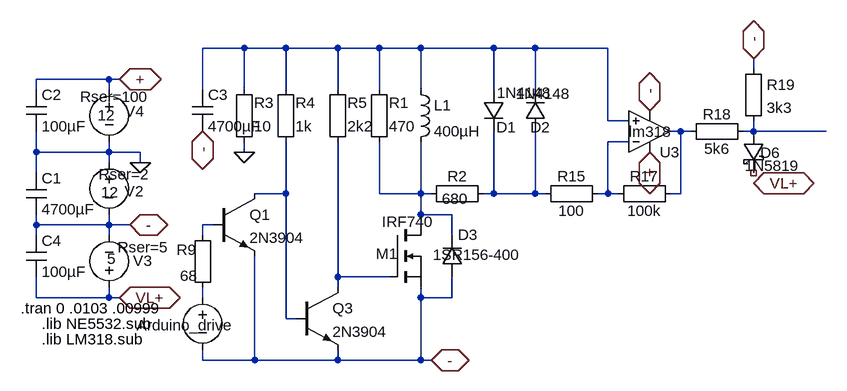
[diagram p0: schematic metal_1110.asc]
metal_1110.asc, the LTspice schematic file:
Version 4
SHEET 1 6068 1612
WIRE 128 -2400 64 -2400
WIRE 192 -2400 128 -2400
WIRE 272 -2400 192 -2400
WIRE 336 -2400 272 -2400
WIRE 400 -2400 336 -2400
WIRE 512 -2400 400 -2400
WIRE 576 -2400 512 -2400
WIRE 688 -2400 576 -2400
WIRE 912 -2368 912 -2384
WIRE -80 -2352 -192 -2352
WIRE -64 -2352 -80 -2352
WIRE -192 -2336 -192 -2352
WIRE -80 -2336 -80 -2352
WIRE 64 -2336 64 -2400
WIRE 128 -2336 128 -2400
WIRE 192 -2336 192 -2400
WIRE 272 -2336 272 -2400
WIRE 336 -2336 336 -2400
WIRE 400 -2336 400 -2400
WIRE 512 -2336 512 -2400
WIRE 576 -2336 576 -2400
WIRE 688 -2288 688 -2400
WIRE 720 -2288 688 -2288
WIRE 800 -2272 784 -2272
WIRE 816 -2272 800 -2272
WIRE 912 -2272 912 -2288
WIRE 912 -2272 896 -2272
WIRE 1024 -2272 912 -2272
WIRE 720 -2256 688 -2256
WIRE 912 -2256 912 -2272
WIRE -192 -2240 -192 -2272
WIRE -80 -2240 -80 -2256
WIRE -80 -2240 -192 -2240
WIRE -32 -2240 -80 -2240
WIRE 128 -2240 128 -2256
WIRE -80 -2224 -80 -2240
WIRE -32 -2224 -32 -2240
WIRE -192 -2208 -192 -2240
WIRE 192 -2176 192 -2256
WIRE 192 -2176 144 -2176
WIRE 336 -2176 336 -2256
WIRE 400 -2176 400 -2256
WIRE 400 -2176 336 -2176
WIRE 416 -2176 400 -2176
WIRE 512 -2176 512 -2272
WIRE 512 -2176 496 -2176
WIRE 576 -2176 576 -2272
WIRE 576 -2176 512 -2176
WIRE 592 -2176 576 -2176
WIRE 688 -2176 688 -2256
WIRE 688 -2176 672 -2176
WIRE 704 -2176 688 -2176
WIRE 800 -2176 800 -2272
WIRE 800 -2176 784 -2176
WIRE 400 -2144 400 -2176
WIRE 448 -2144 400 -2144
WIRE -192 -2128 -192 -2144
WIRE -80 -2128 -80 -2144
WIRE -80 -2128 -192 -2128
WIRE -48 -2128 -80 -2128
WIRE 80 -2128 64 -2128
WIRE 400 -2128 400 -2144
WIRE -192 -2112 -192 -2128
WIRE -80 -2112 -80 -2128
WIRE 64 -2112 64 -2128
WIRE 448 -2112 448 -2144
WIRE 272 -2048 272 -2256
WIRE 352 -2048 272 -2048
WIRE 272 -2032 272 -2048
WIRE -192 -2016 -192 -2048
WIRE -80 -2016 -80 -2032
WIRE -80 -2016 -192 -2016
WIRE -64 -2016 -80 -2016
WIRE 64 -2016 64 -2032
WIRE 400 -2016 400 -2032
WIRE 448 -2016 448 -2048
WIRE 448 -2016 400 -2016
WIRE 192 -1984 192 -2176
WIRE 208 -1984 192 -1984
WIRE 64 -1920 64 -1936
WIRE 144 -1920 144 -2080
WIRE 144 -1920 64 -1920
WIRE 272 -1920 272 -1936
WIRE 272 -1920 144 -1920
WIRE 400 -1920 400 -2016
WIRE 400 -1920 272 -1920
WIRE 416 -1920 400 -1920
FLAG 64 -2272 -
IOPIN 64 -2272 BiDir
FLAG -48 -2128 -
IOPIN -48 -2128 BiDir
FLAG -64 -2352 +
IOPIN -64 -2352 BiDir
FLAG -32 -2224 0
FLAG 128 -2240 0
FLAG -64 -2016 VL+
IOPIN -64 -2016 BiDir
FLAG 752 -2240 +
IOPIN 752 -2240 BiDir
FLAG 752 -2304 -
IOPIN 752 -2304 BiDir
FLAG 912 -2384 -
IOPIN 912 -2384 BiDir
FLAG 912 -2192 VL+
IOPIN 912 -2192 BiDir
FLAG 416 -1920 -
IOPIN 416 -1920 BiDir
SYMBOL Misc\\EuropeanCap 48 -2336 R0
SYMATTR InstName C3
SYMATTR Value 4700µF
SYMATTR SpiceLine V=400 Irms=1 Rser=.32 Lser=0
SYMBOL ind 384 -2352 R0
SYMATTR InstName L1
SYMATTR Value 400µH
SYMATTR SpiceLine Rser=.5 Cpar=200p
SYMBOL Misc\\EuropeanResistor 320 -2240 M180
WINDOW 0 31 76 Left 2
WINDOW 3 31 40 Left 2
SYMATTR InstName R1
SYMATTR Value 470
SYMBOL Misc\\EuropeanResistor 400 -2192 M90
WINDOW 0 5 56 VBottom 2
WINDOW 3 8 53 VTop 2
SYMATTR InstName R2
SYMATTR Value 680
SYMBOL diode 496 -2336 R0
WINDOW 3 21 5 Left 2
WINDOW 0 20 58 Left 2
SYMATTR Value 1N4148
SYMATTR InstName D1
SYMBOL diode 592 -2272 R180
WINDOW 0 -7 6 Left 2
WINDOW 3 -39 58 Left 2
SYMATTR InstName D2
SYMATTR Value 1N4148
SYMBOL Misc\\EuropeanResistor 112 -2240 M180
WINDOW 0 31 76 Left 2
WINDOW 3 31 40 Left 2
SYMATTR InstName R3
SYMATTR Value 10
SYMBOL nmos 352 -2128 R0
WINDOW 0 -21 44 Left 2
WINDOW 3 -12 -5 Left 2
SYMATTR InstName M1
SYMATTR Value IRF740
SYMBOL voltage 64 -2032 M0
WINDOW 0 -48 58 Left 2
WINDOW 3 -134 119 Invisible 2
WINDOW 123 0 0 Left 2
SYMATTR InstName Arduino_drive
SYMATTR Value PULSE(0 4.8 .01 0 0 .00015 .1 1000)
SYMATTR SpiceLine Rser=0
SYMBOL voltage -80 -2240 M0
WINDOW 123 0 0 Left 2
WINDOW 39 -63 34 Left 2
WINDOW 0 -53 60 Left 2
WINDOW 3 -15 62 Left 2
SYMATTR SpiceLine Rser=2
SYMATTR InstName V2
SYMATTR Value 12
SYMBOL voltage -80 -2352 M0
WINDOW 123 0 0 Left 2
WINDOW 39 -61 27 Left 2
WINDOW 0 -54 49 Left 2
WINDOW 3 -9 55 Left 2
SYMATTR SpiceLine Rser=100
SYMATTR InstName V4
SYMATTR Value 12
SYMBOL voltage -80 -2016 M180
WINDOW 123 0 0 Left 2
WINDOW 39 13 78 Left 2
WINDOW 0 37 57 Left 2
WINDOW 3 -3 60 Left 2
SYMATTR SpiceLine Rser=5
SYMATTR InstName V3
SYMATTR Value 5
SYMBOL npn3 80 -2176 R0
SYMATTR InstName Q1
SYMATTR Value 2N3904
SYMBOL Misc\\EuropeanResistor 176 -2240 M180
WINDOW 0 31 76 Left 2
WINDOW 3 31 40 Left 2
SYMATTR InstName R4
SYMATTR Value 1k
SYMBOL Misc\\EuropeanResistor 48 -2016 M180
WINDOW 0 -24 74 Left 2
WINDOW 3 -19 34 Left 2
SYMATTR InstName R9
SYMATTR Value 68
SYMBOL Misc\\EuropeanCap -208 -2208 R0
SYMATTR InstName C1
SYMATTR Value 4700µF
SYMATTR SpiceLine V=400 Irms=1 Rser=.32 Lser=0
SYMBOL Misc\\EuropeanCap -208 -2336 R0
SYMATTR InstName C2
SYMATTR Value 100µF
SYMATTR SpiceLine V=400 Irms=1 Rser=.32 Lser=0
SYMBOL Misc\\EuropeanCap -208 -2112 R0
SYMATTR InstName C4
SYMATTR Value 100µF
SYMATTR SpiceLine V=400 Irms=1 Rser=.32 Lser=0
SYMBOL Opamps\\opamp2 752 -2208 M180
WINDOW 3 -32 63 Left 2
SYMATTR Value lm318
SYMATTR InstName U3
SYMBOL Misc\\EuropeanResistor 576 -2160 R270
WINDOW 0 27 56 VTop 2
WINDOW 3 5 56 VBottom 2
SYMATTR InstName R15
SYMATTR Value 100
SYMBOL Misc\\EuropeanResistor 688 -2160 R270
WINDOW 0 27 56 VTop 2
WINDOW 3 5 56 VBottom 2
SYMATTR InstName R17
SYMATTR Value 100k
SYMBOL Misc\\EuropeanResistor 800 -2288 M90
WINDOW 0 5 56 VBottom 2
WINDOW 3 27 56 VTop 2
SYMATTR InstName R18
SYMATTR Value 5k6
SYMBOL Misc\\EuropeanResistor 896 -2384 R0
SYMATTR InstName R19
SYMATTR Value 3k3
SYMBOL schottky 928 -2272 M0
WINDOW 0 -25 33 Left 2
WINDOW 3 -55 53 Left 2
SYMATTR InstName D6
SYMATTR Value 1N5819
SYMATTR Description Diode
SYMATTR Type diode
SYMBOL npn3 208 -2032 R0
SYMATTR InstName Q3
SYMATTR Value 2N3904
SYMBOL diode 464 -2048 R180
WINDOW 0 -24 65 Left 2
WINDOW 3 -90 34 Left 2
SYMATTR InstName D3
SYMATTR Value 1SR156-400
SYMATTR Description Zener Diode
SYMATTR Type zener
SYMBOL Misc\\EuropeanResistor 256 -2240 M180
WINDOW 0 31 76 Left 2
WINDOW 3 31 40 Left 2
SYMATTR InstName R5
SYMATTR Value 2k2
TEXT -216 -2000 Left 2 !.tran 0 .0103 .00999
TEXT -184 -1976 Left 2 !.lib NE5532.sub
TEXT -184 -1952 Left 2 !.lib LM318.sub

The netlist it stands for:
* metal_1110.asc
C3 N001 - 4700µF V=400 Irms=1 Rser=.32 Lser=0
L1 N001 N006 400µH Rser=.5 Cpar=200p
R1 N006 N001 470
R2 N006 N007 680
D1 N001 N007 1N4148
D2 N007 N001 1N4148
R3 0 N001 10
M1 N006 N009 - - IRF740
V§Arduino_drive N010 - PULSE(0 4.8 .01 0 0 .00015 .1 1000) Rser=0
V2 0 - 12 Rser=2
V4 + 0 12 Rser=100
V3 VL+ - 5 Rser=5
Q1 N005 N008 - 0 2N3904
R4 N005 N001 1k
R9 N010 N008 68
C1 0 - 4700µF V=400 Irms=1 Rser=.32 Lser=0
C2 + 0 100µF V=400 Irms=1 Rser=.32 Lser=0
C4 - VL+ 100µF V=400 Irms=1 Rser=.32 Lser=0
XU3 N001 N004 + - N002 lm318  ; pins In+ In- V+ V- OUT
R15 N007 N004 100
R17 N004 N002 100k
R18 N002 N003 5k6
R19 - N003 3k3
D6 N003 NC_01 1N5819
Q3 N009 N005 - 0 2N3904
D3 - N006 1SR156-400
R5 N009 N001 2k2
.model D D
.lib standard.dio
.model NPN NPN
.model PNP PNP
.lib standard.bjt
.model NMOS NMOS
.model PMOS PMOS
.lib standard.mos
.tran 0 .0103 .00999
.lib NE5532.sub
.lib LM318.sub
.backanno
.end